# EasyEDA Pro project stm32-motordrive.epro, board PCB3_copy
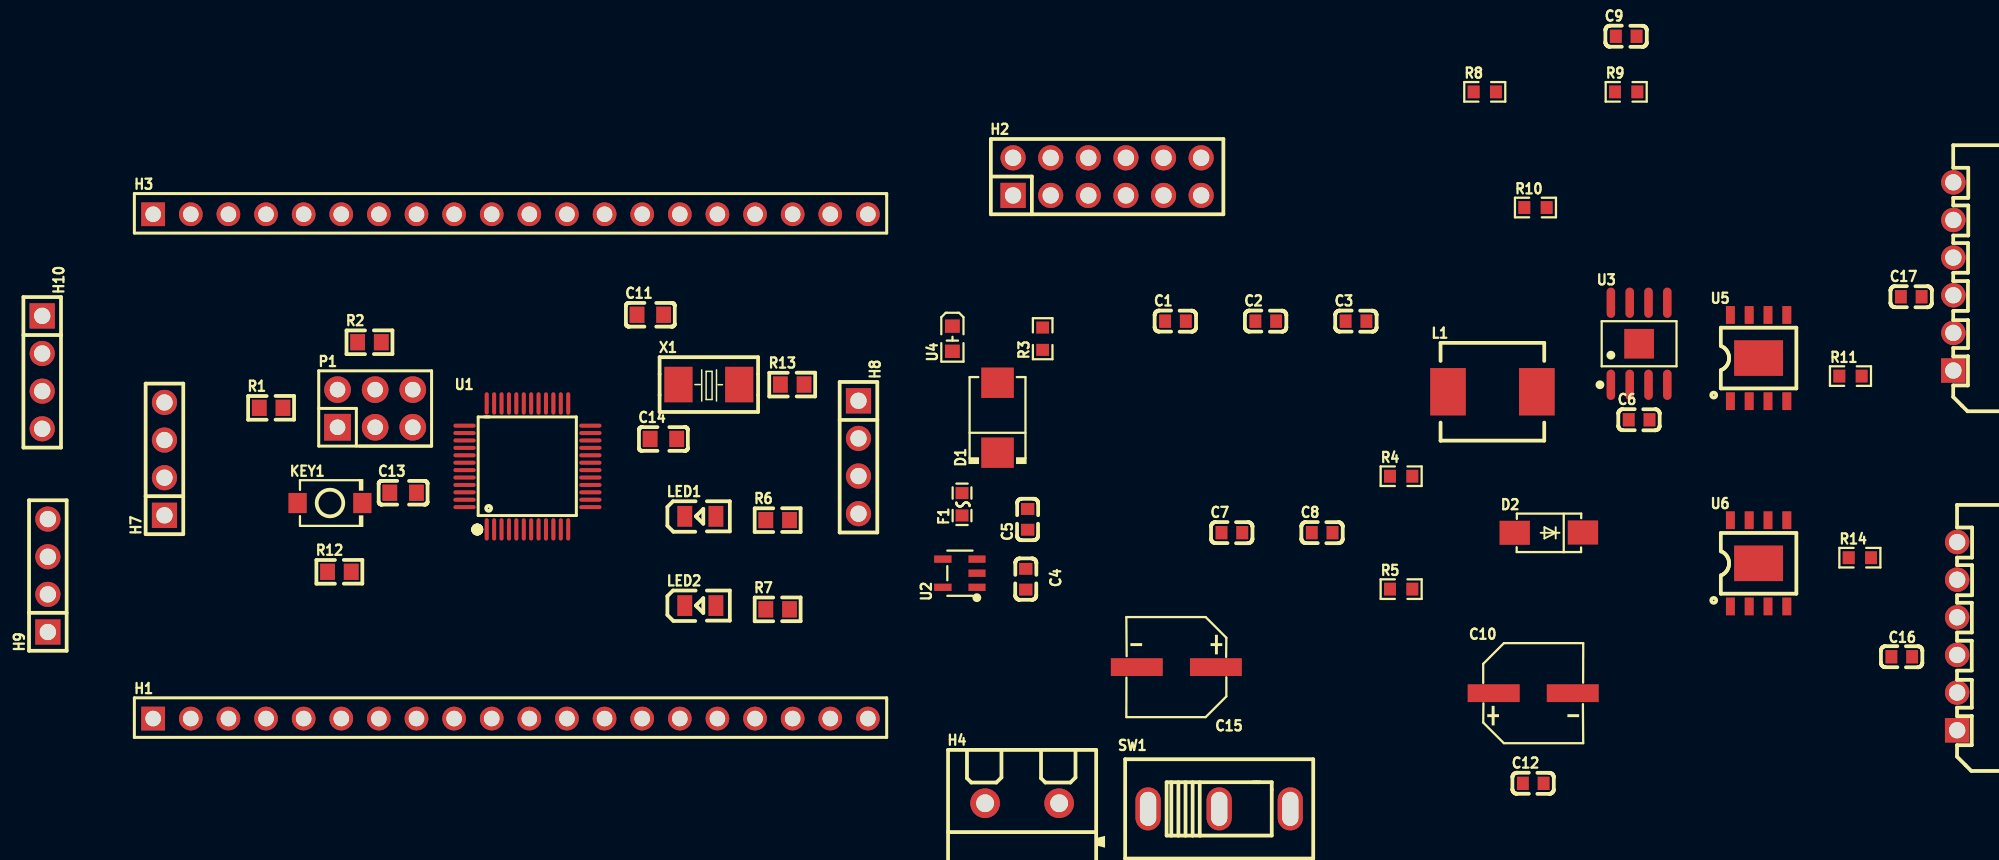
[diagram p11: board, top side]
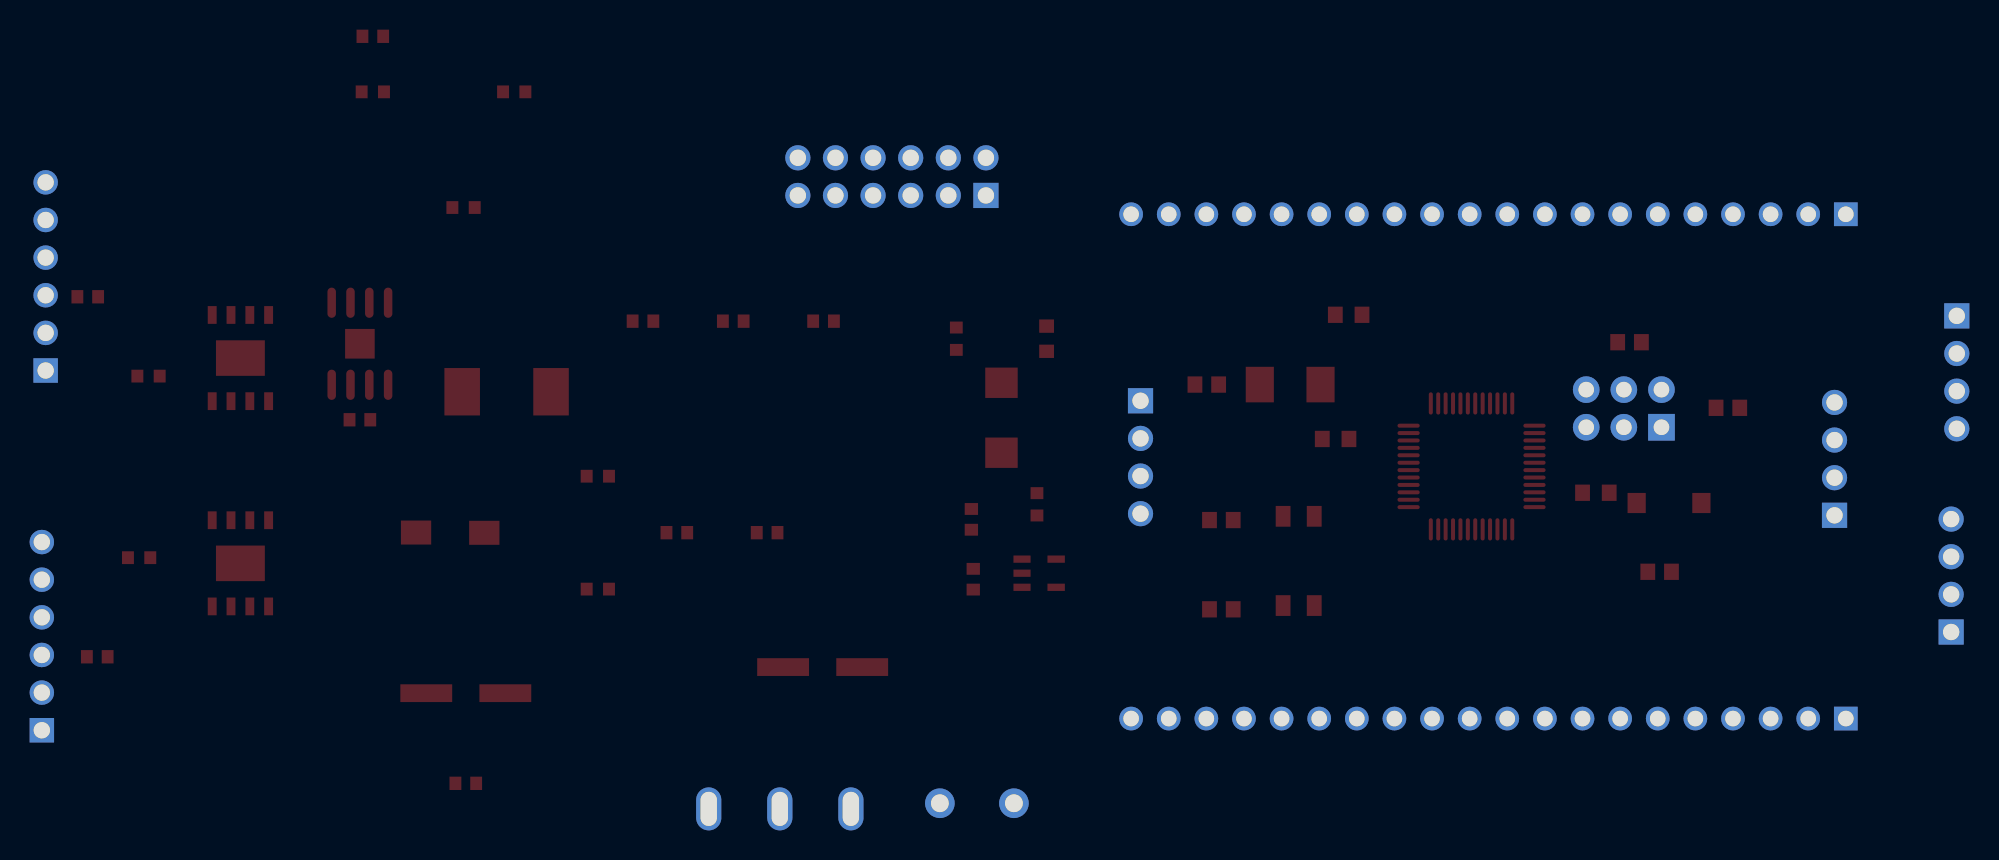
[diagram p12: board, bottom side, seen from below]

No outline. copper layers: Top Layer, Bottom Layer. Coordinates in mm from the lowest, leftmost part position.
Stack: Top Layer 0.035mm / Dielectric1 1.51mm FR4 er 4.5 / Bottom Layer 0.035mm

## Design rules (mm)
template: JLCPCB Capability(Two Layers Board)
spacing copperThickness1oz (default): track to track 0.102, other pairs 0.152 to 0.3
spacing copperThickness2oz: track to track 0.203, other pairs 0.152 to 0.3
track width copperThickness1oz (default): min 0.127, default 0.254, max 2.54
track width copperThickness2oz: min 0.203, default 0.254, max 2.54
differential pair differentialPair (default): width min 0.127, default 0.254, max 2.54; gap min 0.152, default 0.152
via viaSize (default): diameter min 0.5, default 0.61, max 10; hole min 0.3, default 0.305, max 6.3

## Placement (name value [footprint] x y rotation side)
C1  47uF  [C0603]  76.52 32.66 0 top
C2  22uF  [C0603]  82.62 32.66 0 top
C3  4.7uF  [C0603]  88.71 32.66 0 top
C4  1uF  [C0603]  66.41 15.25 270 top
C5  1uF  [C0603]  66.54 19.29 90 top
C6  10nF  [C0603]  107.83 26.01 0 top
C7  22nF  [C0603]  80.33 18.39 0 top
C8  4.7uF  [C0603]  86.43 18.39 0 top
C9  100nF  [C0603]  106.96 51.89 0 top
C10  220uF 25V  [CAP-SMD_BD6.3-L6.6-W6.6-LS7.2-FD]  100.68 7.56 0 top
C11  22P  [C0603#2]  41.06 33.09 0 top
C12  0.1uF  [C0603]  100.68 1.47 0 top
C13  104  [C0603#2]  24.37 21.08 0 top
C14  22P  [C0603#2]  41.94 24.71 0 top
C15  220uF 25V  [CAP-SMD_BD6.3-L6.6-W6.6-LS7.2-FD]  76.58 9.32 180 top
C16  0.1uF  [C0603]  125.56 10.01 0 top
C17  0.1uF  [C0603]  126.21 34.31 0 top
D1  SMBJ3.3A  [SMB_L4.6-W3.6-LS5.3-RD]  64.51 26.14 90 top
D2  SS54  [SMA_L4.3-W2.6-LS5.0-FD]  101.73 18.39 0 top
F1  BSMD0603-050-6V  [F0603]  62.11 20.3 90 top
H1  2.54-1*20  [HDR-TH_20P-P2.54-V-M]  31.62 5.84 0 top
H2  A2541WV-2x6P  [HDR-TH_12P-P2.54-V-M-R2-C6-S2.54]  71.91 42.42 0 top
H3  2.54-1*20  [HDR-TH_20P-P2.54-V-M]  31.62 39.88 0 top
H4  XY301V-A-5.0-2P  [CONN-TH_XY301V-A-5.0-2P]  66.17 0.13 0 top
H5  -  [XH2.54-LI-6P弯针]  132.86 10.03 180 top
H6  -  [XH2.54-LI-6P弯针]  132.6 34.31 180 top
H7  PZ254V-11-04P  [HDR-TH_4P-P2.54-V-M]  8.25 23.37 90 top
H8  PZ254V-11-04P  [HDR-TH_4P-P2.54-V-M]  55.12 23.48 270 top
H9  PZ254V-11-04P  [HDR-TH_4P-P2.54-V-M]  0.38 15.49 90 top
H10  PZ254V-11-04P  [HDR-TH_4P-P2.54-V-M]  0 29.21 270 top
KEY1  TS-1088-AR02016  [SW-SMD_L3.9-W3.0-P4.45]  19.43 20.39 0 top
L1  6.8uH  [IND-SMD_L7.0-W6.6]  97.92 27.9 0 top
LED1  NCD0805R1  [LED0805-R-RD]  44.44 19.49 0 top
LED2  NCD0805R1  [LED0805-R-RD]  44.44 13.47 0 top
P1  2.54-2*3P针  [HDR-TH_6P-P2.54-V-M-R2-C3-S2.54-1]  22.48 26.77 0 top
R1  10k  [R0603#2]  15.46 26.81 0 top
R2  10k  [R0603#2]  22.1 31.24 0 top
R3  1K  [R0603]  67.55 31.48 90 top
R4  10K(%0.1)  [R0603]  91.76 22.2 0 top
R5  3.3K  [R0603]  91.76 14.58 0 top
R6  510R  [R0603#2]  49.66 19.24 0 top
R7  510R  [R0603#2]  49.66 13.21 0 top
R8  10K(%0.1)  [R0603]  97.41 48.14 0 top
R9  6.8kNTC  [R0603]  106.96 48.14 0 top
R10  0  [R0603]  100.83 40.33 0 top
R11  R250  [R0603]  122.1 28.96 0 top
R12  10k  [R0603#2]  20.07 15.75 0 top
R13  1M  [R0603#2]  50.64 28.38 0 top
R14  R250  [R0603]  122.74 16.7 0 top
SW1  -  [SW-TH_SHOU-HAN_SS12D10G4]  79.85 0 0 top
U1  STM32F103C8T6  [LQFP-48_L7.0-W7.0-P0.50-LS9.0-BL]  32.77 22.86 0 top
U2  RT9013-33GB  [SOT-23-5_L3.0-W1.7-P0.95-LS2.8-BL]  61.97 15.65 90 top
U3  RT8289GSP  [SOIC-8_L5.0-W4.0-P1.27-LS6.0-BL-EP2.0]  107.83 31.14 0 top
U4  YLED0603R  [LED0603-FD]  61.46 31.48 90 top
U5  AT8236  [ESOP-8_L4.9-W3.9-P1.27-LS6.0-BL-EP]  115.9 30.17 0 top
U6  AT8236  [ESOP-8_L4.9-W3.9-P1.27-LS6.0-BL-EP]  115.9 16.32 0 top
X1  8MHz  [CRYSTAL-SMD_L5.0-W3.2]  45.01 28.38 0 top

## Footprints (pads in the part's own frame, mm; a bottom-side part is the same pattern mirrored in y, then rotated)
C0603
  rect 0.8x0.9 smd: 1(-0.7,0) 2(0.7,0)
C0603#2
  rect 1x1.1 smd: 1(0.9,0) 2(-0.9,0)
CAP-SMD_BD6.3-L6.6-W6.6-LS7.2-FD
  rect 3.5x1.2 smd: 1(-2.67,0) 2(2.67,0)
CONN-TH_XY301V-A-5.0-2P
  round 2 hole 1.2: 1(-2.5,0) 2(2.5,0)
CRYSTAL-SMD_L5.0-W3.2
  rect 1.9x2.4 smd: 1(-2.05,0) 2(2.05,0)
ESOP-8_L4.9-W3.9-P1.27-LS6.0-BL-EP
  rect 0.6x1.2 smd: 1(-1.905,-2.909) 2(-0.635,-2.909) 3(0.635,-2.909) 4(1.905,-2.909) 5(1.905,2.909) 6(0.635,2.909) 7(-0.635,2.909) 8(-1.905,2.909)
  rect 3.3x2.4 smd: 9(0,0)
F0603
  rect 0.806x0.864 smd: 1(-0.753,0) 2(0.753,0)
HDR-TH_4P-P2.54-V-M
  rect 1.7x1.7 hole 1.1: 1(-3.81,0)
  round 1.7 hole 1.1: 2(-1.27,0) 3(1.27,0) 4(3.81,0)
HDR-TH_6P-P2.54-V-M-R2-C3-S2.54-1
  rect 1.8x1.8 hole 1.05: 1(-2.54,-1.27)
  round 1.8 hole 1.05: 2(-2.54,1.27) 3(0,-1.27) 4(0,1.27) 5(2.54,-1.27) 6(2.54,1.27)
HDR-TH_12P-P2.54-V-M-R2-C6-S2.54
  rect 1.7x1.7 hole 1.1: 1(-6.35,-1.27)
  round 1.7 hole 1.1: 2(-6.35,1.27) 3(-3.81,-1.27) 4(-3.81,1.27) 5(-1.27,-1.27) 6(-1.27,1.27) 7(1.27,-1.27) 8(1.27,1.27) 9(3.81,-1.27) 10(3.81,1.27) 11(6.35,-1.27) 12(6.35,1.27)
HDR-TH_20P-P2.54-V-M
  rect 1.6x1.6 hole 1.05: 1(-24.13,0)
  round 1.6 hole 1.05: 2(-21.59,0) 3(-19.05,0) 4(-16.51,0) 5(-13.97,0) 6(-11.43,0) 7(-8.89,0) 8(-6.35,0) 9(-3.81,0) 10(-1.27,0) 11(1.27,0) 12(3.81,0) 13(6.35,0) 14(8.89,0) 15(11.43,0) 16(13.97,0) 17(16.51,0) 18(19.05,0) 19(21.59,0) 20(24.13,0)
IND-SMD_L7.0-W6.6
  rect 2.4x3.2 smd: 1(-3,0) 2(3,0)
LED0603-FD
  rect 0.9x1 smd: 1(-0.85,0) 2(0.85,0)
LED0805-R-RD
  rect 1x1.399 smd: 1(1.05,0) 2(-1.05,0)
LQFP-48_L7.0-W7.0-P0.50-LS9.0-BL
  oval 0.27x1.5 smd: 1(-2.75,-4.25) 2(-2.25,-4.25) 3(-1.75,-4.25) 4(-1.25,-4.25) 5(-0.75,-4.25) 6(-0.25,-4.25) 7(0.25,-4.25) 8(0.75,-4.25) 9(1.25,-4.25) 10(1.75,-4.25) 11(2.25,-4.25) 12(2.75,-4.25) 25(2.75,4.25) 26(2.25,4.25) 27(1.75,4.25) 28(1.25,4.25) 29(0.75,4.25) 30(0.25,4.25) 31(-0.25,4.25) 32(-0.75,4.25) 33(-1.25,4.25) 34(-1.75,4.25) 35(-2.25,4.25) 36(-2.75,4.25)
  oval 1.5x0.27 smd: 13(4.25,-2.75) 14(4.25,-2.25) 15(4.25,-1.75) 16(4.25,-1.25) 17(4.25,-0.75) 18(4.25,-0.25) 19(4.25,0.25) 20(4.25,0.75) 21(4.25,1.25) 22(4.25,1.75) 23(4.25,2.25) 24(4.25,2.75) 37(-4.25,2.75) 38(-4.25,2.25) 39(-4.25,1.75) 40(-4.25,1.25) 41(-4.25,0.75) 42(-4.25,0.25) 43(-4.25,-0.25) 44(-4.25,-0.75) 45(-4.25,-1.25) 46(-4.25,-1.75) 47(-4.25,-2.25) 48(-4.25,-2.75)
R0603
  rect 0.806x0.864 smd: 1(-0.753,0) 2(0.753,0)
R0603#2
  rect 1x1.1 smd: 1(0.8,0) 2(-0.8,0)
SMA_L4.3-W2.6-LS5.0-FD
  rect 2.046x1.62 smd: 1(-2.304,-0.009) 2(2.304,0.009)
SMB_L4.6-W3.6-LS5.3-RD
  rect 2.047x2.192 smd: 1(-2.361,0) 2(2.361,0)
SOIC-8_L5.0-W4.0-P1.27-LS6.0-BL-EP2.0
  oval 0.574x2.038 smd: 1(-1.905,-2.769) 2(-0.635,-2.769) 3(0.635,-2.769) 4(1.905,-2.769) 5(1.905,2.769) 6(0.635,2.769) 7(-0.635,2.769) 8(-1.905,2.769)
  rect 2x2 smd: 9(0,0)
SOT-23-5_L3.0-W1.7-P0.95-LS2.8-BL
  rect 0.49x1.157 smd: 1(-0.95,-1.153) 2(0,-1.153) 3(0.95,-1.153)
  rect 0.49x1.175 smd: 4(0.95,1.153) 5(-0.95,1.153)
SW-SMD_L3.9-W3.0-P4.45
  rect 1.23x1.36 smd: 1(-2.185,0) 2(2.185,0)
SW-TH_SHOU-HAN_SS12D10G4
  oval 1.7x2.9 hole 1.1x2.3: 1(-5.181,-0.254) 2(-0.381,-0.254) 3(4.419,-0.254)
XH2.54-LI-6P弯针
  rect 1.65x1.65 hole 1.1: 1(3.556,4.979)
  round 1.65 hole 1.1: 2(3.556,2.438) 3(3.556,-0.102) 4(3.556,-2.642) 5(3.556,-5.181) 6(3.556,-7.721)

## Nets
As in the schematic.

Pads without a net: SW1 3; U2 4; U3 2 3
